# Altium schematic sheet Power_Line_5V.SchDoc: PDM
size A3; SheetNumber: 3; SheetTotal: 6
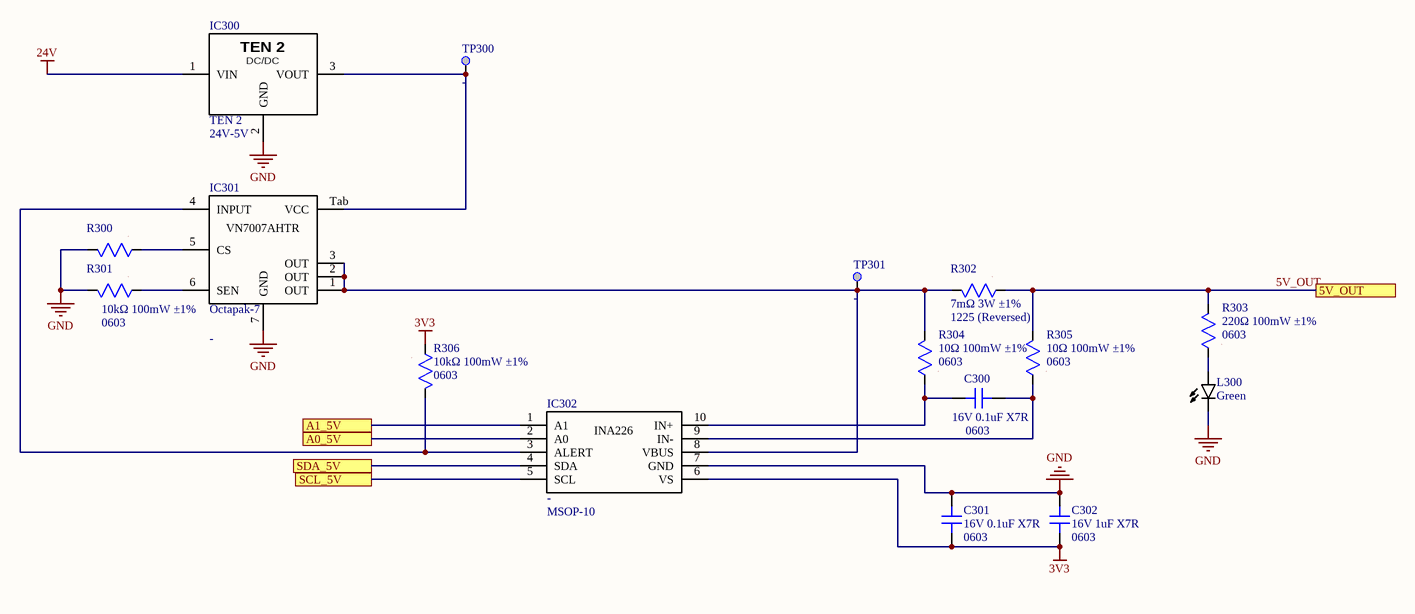
[diagram p0: Power_Line_5V.SchDoc]

## Parts
C300  value 16V 0.1uF X7R  Package: 0603  [CAP SMD 0603]  (hidden comment: CAP non polarized)
C301  value 16V 0.1uF X7R  Package: 0603  [CAP SMD 0603]  (hidden comment: CAP non polarized)
C302  value 16V 1uF X7R  Package: 0603  [CAP SMD 0603]  (hidden comment: CAP non polarized)
IC300  TEN 2  value 24V-5V  [TEN 2]
IC301  VN7007AHTR  [Octapak-7]  (value not drawn)
IC302  Package: MSOP-10  [VSOP-10]  (hidden comment: INA226)
L300  value Green  [LED SMD 0603]  (hidden comment: LED WHITE)
R300  RES  [RES SMD 0603]  (value not drawn)
R301  value 10kΩ 100mW ±1%  Package: 0603  [RES SMD 0603]  (hidden comment: RES)
R302  value 7mΩ 3W ±1%  Package: 1225 (Reversed)  [RES SMD 1225 Reversed]  (hidden comment: RES)
R303  value 220Ω 100mW ±1%  Package: 0603  [RES SMD 0603]  (hidden comment: RES)
R304  value 10Ω 100mW ±1%  Package: 0603  [RES SMD 0603]  (hidden comment: RES)
R305  value 10Ω 100mW ±1%  Package: 0603  [RES SMD 0603]  (hidden comment: RES)
R306  value 10kΩ 100mW ±1%  Package: 0603  [RES SMD 0603]  (hidden comment: RES)
TP300  Test Point  [TP_SMD_1MM]  (value not drawn)  (no BOM)
TP301  Test Point  [TP_SMD_1MM]  (value not drawn)  (no BOM)

## Ports
5V_OUT, A0_5V, A1_5V, SCL_5V, SDA_5V

## Nets
3V3: C301.2 C302.2 IC302.6(VS) R306.1
24V: IC300.1(VIN)
GND: C301.1 C302.1 IC300.2(GND) IC301.7(GND) IC302.7(GND) L300.C R300.2 R301.2
5V_OUT: R302.1 R303.2 R305.2 ; port 5V_OUT
A0_5V: IC302.2(A0) ; port A0_5V
A1_5V: IC302.1(A1) ; port A1_5V
SCL_5V: IC302.5(SCL) ; port SCL_5V
SDA_5V: IC302.4(SDA) ; port SDA_5V
NetC300_1: C300.1 IC302.10(IN+) R304.1
NetC300_2: C300.2 IC302.9(IN-) R305.1
NetIC300_3: IC300.3(VOUT) IC301.Tab(VCC) TP300.1
NetIC301_1: IC301.1(OUT) IC301.2(OUT) IC301.3(OUT) IC302.8(VBUS) R302.2 R304.2 TP301.1
NetIC301_4: IC301.4(INPUT) IC302.3(ALERT) R306.2
NetIC301_5: IC301.5(CS) R300.1
NetIC301_6: IC301.6(SEN) R301.1
NetL300_A: L300.A R303.1

## Notes on the sheet
- Project:
- Subsystem:
- Company:
- Document:
- Author:
- Revision:
- Date:
- Sheet:
- /
- (in symbol 070-0002) DC/DC

## Library data of the parts
C300 C301 = 001-0112: Condensadores de cerámica multicapa (MLCC- SMD/SMT) WCAP-CSGP 0.1uF 0603 10% 16V MLCC; MPN: 885012206046; Manufacturer: Wurth Elektronik; ComponentLink1Description: Datasheet; ComponentLink1URL: https://www.we-online.com/components/products/datasheet/885012206046.pdf; ComponentLink2Description: Distributor Link; ComponentLink2URL: https://www.mouser.es/ProductDetail/Wurth-Elektronik/885012206046?qs=0KOYDY2FL2%252B89gr6HvTBXA%3D%3D; ID: 001-0112; Distributor PN: 710-885012206046; Distributor: Mouser
C302 = 001-0110: Condensadores de cerámica multicapa (MLCC- SMD/SMT) WCAP-CSGP 1uF 0603 10% 16V MLCC; MPN: 885012206052; Manufacturer: Wurth Elektronik; ComponentLink1Description: Datasheet; ComponentLink1URL: https://www.we-online.com/components/products/datasheet/885012206052.pdf; ComponentLink2Description: Distributor Link; ComponentLink2URL: https://www.mouser.es/ProductDetail/Wurth-Elektronik/885012206052?qs=0KOYDY2FL2%2F2JKabApojcQ%3D%3D; ID: 001-0110; Distributor PN: 710-885012206052; Distributor: Mouser
IC300 = 070-0002: Convertidores DC/DC para montaje pasante 6.5-36Vin 5V 2A SIP switching regulator; MPN: TSR 2-2450; Manufacturer: TRACO Power; ComponentLink1Description: Datasheet; ComponentLink1URL: https://www.tracopower.com/tsr2-datasheet; ComponentLink2Description: Distributor Link; ComponentLink2URL: https://www.mouser.es/ProductDetail/TRACO-Power/TSR-2-2450?qs=NtE2QagKf6RzknAolzm%2FTQ%3D%3D; ID: 070-0002; Package: 14.0x7.5x10.1mm; Distributor PN: 495-TSR2-2450; Distributor: Mouser
IC301 = 050-0002: Controlador de puerta High side driver with current sense analog feedback for automotive applications; Manufacturer: 511-VN7007AHTR; ComponentLink1Description: Datasheet; ComponentLink1URL: https://www.st.com/resource/en/datasheet/vn7007ah.pdf; ComponentLink2Description: Distributor Link; ComponentLink2URL: https://www.mouser.es/ProductDetail/STMicroelectronics/VN7007AHTR?qs=mKNKSX85ZJecQmIqUrqpTA%3D%3D; ID: 050-0002; Value: -; Package: Octapak-7; MPN: VN7007AHTR; Distributor PN: STMicroelectronics; Distributor: Mouser
IC302 = 050-0001: Monitores y reguladores de corriente y energía Hi-Side Msmt Bi-Dir Current/Pwr Mon A 59 A 595-INA226AIDGST; MPN: INA226AIDGSR; Manufacturer: 595-INA226AIDGSR; ComponentLink1Description: Datasheet; ComponentLink1URL: https://www.ti.com/lit/ds/symlink/ina226.pdf?ts=1772078114731&ref_url=https%253A%252F%252Fwww.ti.com%252Fproduct%252FINA226; ComponentLink2Description: Distributor Link; ComponentLink2URL: https://www.mouser.es/ProductDetail/Texas-Instruments/INA226AIDGSR?qs=tQG3bEuiOZD4quG3egR36g%3D%3D&srsltid=AfmBOopOjh8KVXQVeHwZlO8DxeOetC6-xgaoNkKslHEV4iGJ_SkIIo7K; ID: 050-0001; Value: -; Distributor PN: Texas Instruments; Distributor: Mouser
L300 = 033-0023: LED de un solo color Green 525nm 1400mcd 2.85V 73deg 0603; MPN: VLMTG1400-GS08; Manufacturer: Vishay Semiconductors; ComponentLink1Description: Datasheet; ComponentLink1URL: https://www.vishay.com/docs/84393/vlmtg1400.pdf; ComponentLink2Description: Distributor Link; ComponentLink2URL: https://www.mouser.es/ProductDetail/Vishay-Semiconductors/VLMTG1400-GS08?qs=gt1LBUVyoHlZ6yHd8iEIzQ%3D%3D; ID: 033-0023; Package: 0603; Distributor PN: 78-VLMTG1400-GS08; Distributor: Mouser
R300 = 010-0145: Resistores de película gruesa - SMD WRIS-RSKS 10 kOhms 1 % 0.1 W 0603 AEC-Q200; MPN: 560112116005; Manufacturer: Wurth Elektronik; Value: 10kΩ 100mW ±1%; ComponentLink1Description: Datasheet; ComponentLink1URL: https://www.we-online.com/components/products/datasheet/560112116005.pdf; ComponentLink2Description: Distributor Link; ComponentLink2URL: https://www.mouser.es/ProductDetail/Wurth-Elektronik/560112116005?qs=mELouGlnn3dMVSPHwBGouA%3D%3D; Package: 0603; ID: 010-0145; Distributor PN: 710-560112116005; Distributor: Mouser
R301 R306 = 010-0145: Resistores de película gruesa - SMD WRIS-RSKS 10 kOhms 1 % 0.1 W 0603 AEC-Q200; MPN: 560112116005; Manufacturer: Wurth Elektronik; ComponentLink1Description: Datasheet; ComponentLink1URL: https://www.we-online.com/components/products/datasheet/560112116005.pdf; ComponentLink2Description: Distributor Link; ComponentLink2URL: https://www.mouser.es/ProductDetail/Wurth-Elektronik/560112116005?qs=mELouGlnn3dMVSPHwBGouA%3D%3D; ID: 010-0145; Distributor PN: 710-560112116005; Distributor: Mouser
R302 = 015-0003: Resistores de detección de corriente - SMD 3W 0.007ohm 1% 50ppm; MPN: KRL6432E-M-R007-F-T1; Manufacturer: Susumu; ComponentLink1Description: Datasheet; ComponentLink1URL: https://www.mouser.es/datasheet/3/826/1/n_catalog_partition19_en.pdf; ComponentLink2Description: Distributor Link; ComponentLink2URL: https://www.mouser.es/ProductDetail/Susumu/KRL6432E-M-R007-F-T1?qs=FG09h9tFCuA5fgBuyupdEw%3D%3D; ID: 015-0003; Distributor PN: 754-KRL6432EMR007FT1; Distributor: Mouser
R303 = 010-0191: Resistores de película gruesa - SMD WRIS-RSKS 220 Ohms 1 % 0.1 W 0603 AEC-Q200; MPN: 560112116126; Manufacturer: Wurth Elektronik; ComponentLink1Description: Datasheet; ComponentLink1URL: https://www.we-online.com/components/products/datasheet/560112116126.pdf; ComponentLink2Description: Distributor Link; ID: 010-0191; Distributor PN: 710-560112116126; Distributor: Mouser
R304 R305 = 010-0149: Resistores de película gruesa - SMD WRIS-RSKS 10 Ohms 1 % 0.1 W 0603 AEC-Q200; MPN: 560112116013; Manufacturer: Wurth Elektronik; ComponentLink1Description: Datasheet; ComponentLink1URL: https://www.we-online.com/components/products/datasheet/560112116013.pdf; ComponentLink2Description: Distributor Link; ComponentLink2URL: https://www.mouser.es/ProductDetail/Wurth-Elektronik/560112116013?qs=mELouGlnn3f7quibYlpocQ%3D%3D; ID: 010-0149; Distributor PN: 710-560112116013; Distributor: Mouser
TP300 TP301 = 110-0007: ComponentLink1URL: -; ComponentLink1Description: Datasheet; ComponentLink1URL: *; ComponentLink2Description: Distributor Link; ComponentLink2URL: -; ID: 110-0007; Value: -; Package: -; MPN: -; Manufacturer: -; Distributor PN: -; Distributor: -